# Altium schematic sheet Dimmer.SchDoc: ШИМ контроллер
size A4; Organization: Altium Limited; Address1: L3, 12a Rodborough Rd; Address2: Frenchs Forest; Address3: NSW; Address4: Australia 2086
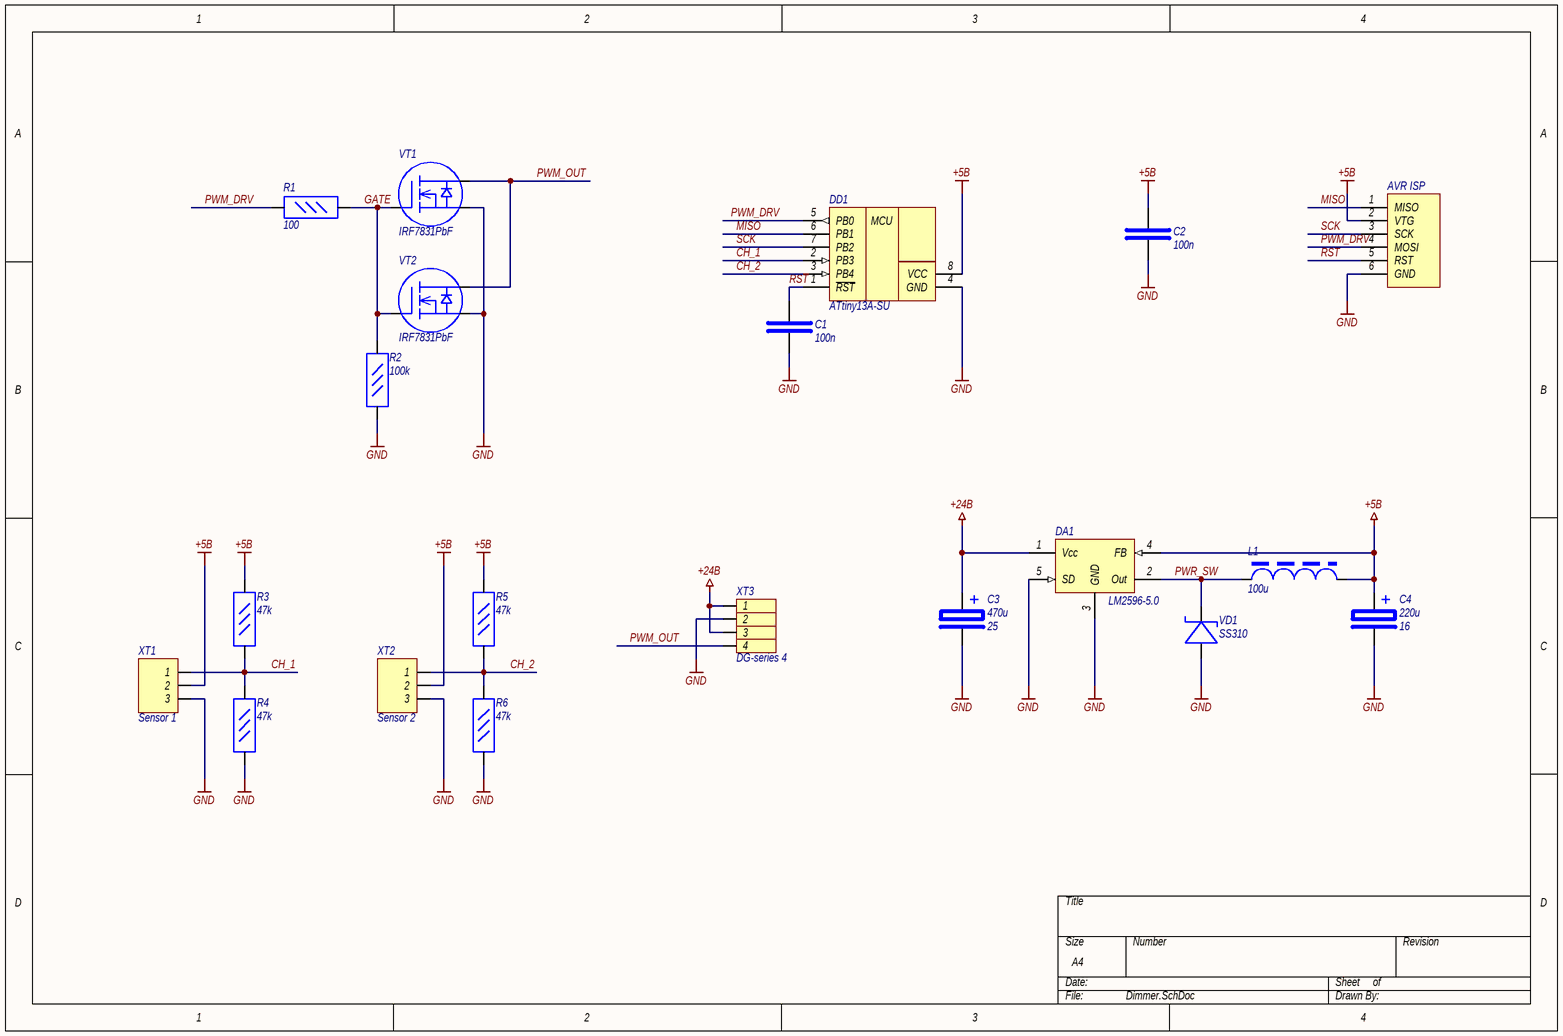
[diagram p0: Dimmer.SchDoc]

## Parts
C1  100n  [CC0603]
C2  100n  [CC0603]
C3  470u  Umax: 25  [CE 8x16-3.5]
C4  220u  Umax: 16  [CE 6.3x12-2.5]
DA1  LM2596-5.0  [TO-263-5]
DD1  ATtiny13A-SU  [SOIC-8-208]
ISP  AVR ISP  [ISP-6]
L1  100u  [HA78D]
R1  100  [RL0603]
R2  100k  [RL0603]
R3  47k  [RL0603]
R4  47k  [RL0603]
R5  47k  [RL0603]
R6  47k  [RL0603]
VD1  SS310  [DO-214AA]
VT1  IRF7831PbF  [SOIC-8-150-SSSGDDDD]
VT2  IRF7831PbF  [SOIC-8-150-SSSGDDDD]
XT1  Sensor 1  [HDR1X3]
XT2  Sensor 2  [HDR1X3]
XT3  DG-series 4  [DG126-5.0-04P]

## Nets
+5В: C2.2 C4.2 DA1.4(FB) DD1.8(VCC) ISP.2(VTG) L1.2 R3.2 R5.2 XT1.2 XT2.2
+24В: C3.2 DA1.1(Vcc) XT3.1 XT3.3
GND: C1.1 C2.1 C3.1 C4.1 DA1.3(GND) DA1.5(SD) DD1.4(GND) ISP.6(GND) R2.1 R4.1 R6.1 VD1.A(Anode) VT1.S VT2.S XT1.3 XT2.3 XT3.2
~{RST}: C1.2 DD1.1(~{RST}) ISP.5(RST)
CH_1: DD1.2(PB3) R3.1 R4.2 XT1.1
CH_2: DD1.3(PB4) R5.1 R6.2 XT2.1
GATE: R1.2 R2.2 VT1.G VT2.G
MISO: DD1.6(PB1) ISP.1(MISO)
PWM_DRV: DD1.5(PB0) ISP.4(MOSI) R1.1
PWM_OUT: VT1.D VT2.D XT3.4
PWR_SW: DA1.2(Out) L1.1 VD1.C(Cathode)
SCK: DD1.7(PB2) ISP.3(SCK)

## Notes on the sheet
- Title
- Size:
- Date:
- A4
- Number:
- Time:
- Revision:
- Sheet
- of
- File:
- (in symbol ATtiny13A) MCU

## Library data of the parts
C1 C2 = Ceramic Capacitor: Umax: 16В; Value: 100n
C3 C4 = Electrolythic Capacitor: Polarized electrolythic capacitor
  C3: Value: 470u
  C4: Value: 220u
DA1 = LM2596-5.0: 4.5V to 40V, 3A Low Component Count Step-Down Regulator; Imax: 3; Umax: 40; ComponentLink1Description: Datasheet; ComponentLink1URL: https://www.ti.com/lit/ds/symlink/lm2596.pdf; ComponentLink2Description: PCB Layout Guidelines; ComponentLink2URL: https://www.ti.com/lit/an/snva054c/snva054c.pdf
DD1 = ATtiny13A: 8-bit AVR microcontroller; ComponentLink1Description: Datasheet; ComponentLink1URL: http://ww1.microchip.com/downloads/en/DeviceDoc/doc8126.pdf
L1 = Inductor non-conductive core: Abstract inductor with non-conductive core; Value: 100u
R1-R6 = Resistor 1/16W: Chip Resistor 1/16W
  R1: Value: 100
  R2: Value: 100k
  R3-R6: Value: 47k
VD1 = SS310: Rectifier Schottky diode; Umax: 100; Imax: 3; ComponentLink1Description: Datasheet; ComponentLink1URL: https://www.wontop.com/uploadfiles/56/sort_excel/pdf/ss32.pdf
VT1 VT2 = IRF7831PbF: N-channel Power MOSFET; Umax: 30; Imax: 17; ComponentLink1Description: Datasheet; ComponentLink1URL: https://www.infineon.com/dgdl/irf7831pbf.pdf?fileId=5546d462533600a401535608fe711d10
XT1 XT2 = Header 3: Header, 3-Pin
XT3 = DG-series 4: Terminal block